# Altium project PX4FLOW2.0_X0.PrjPcb
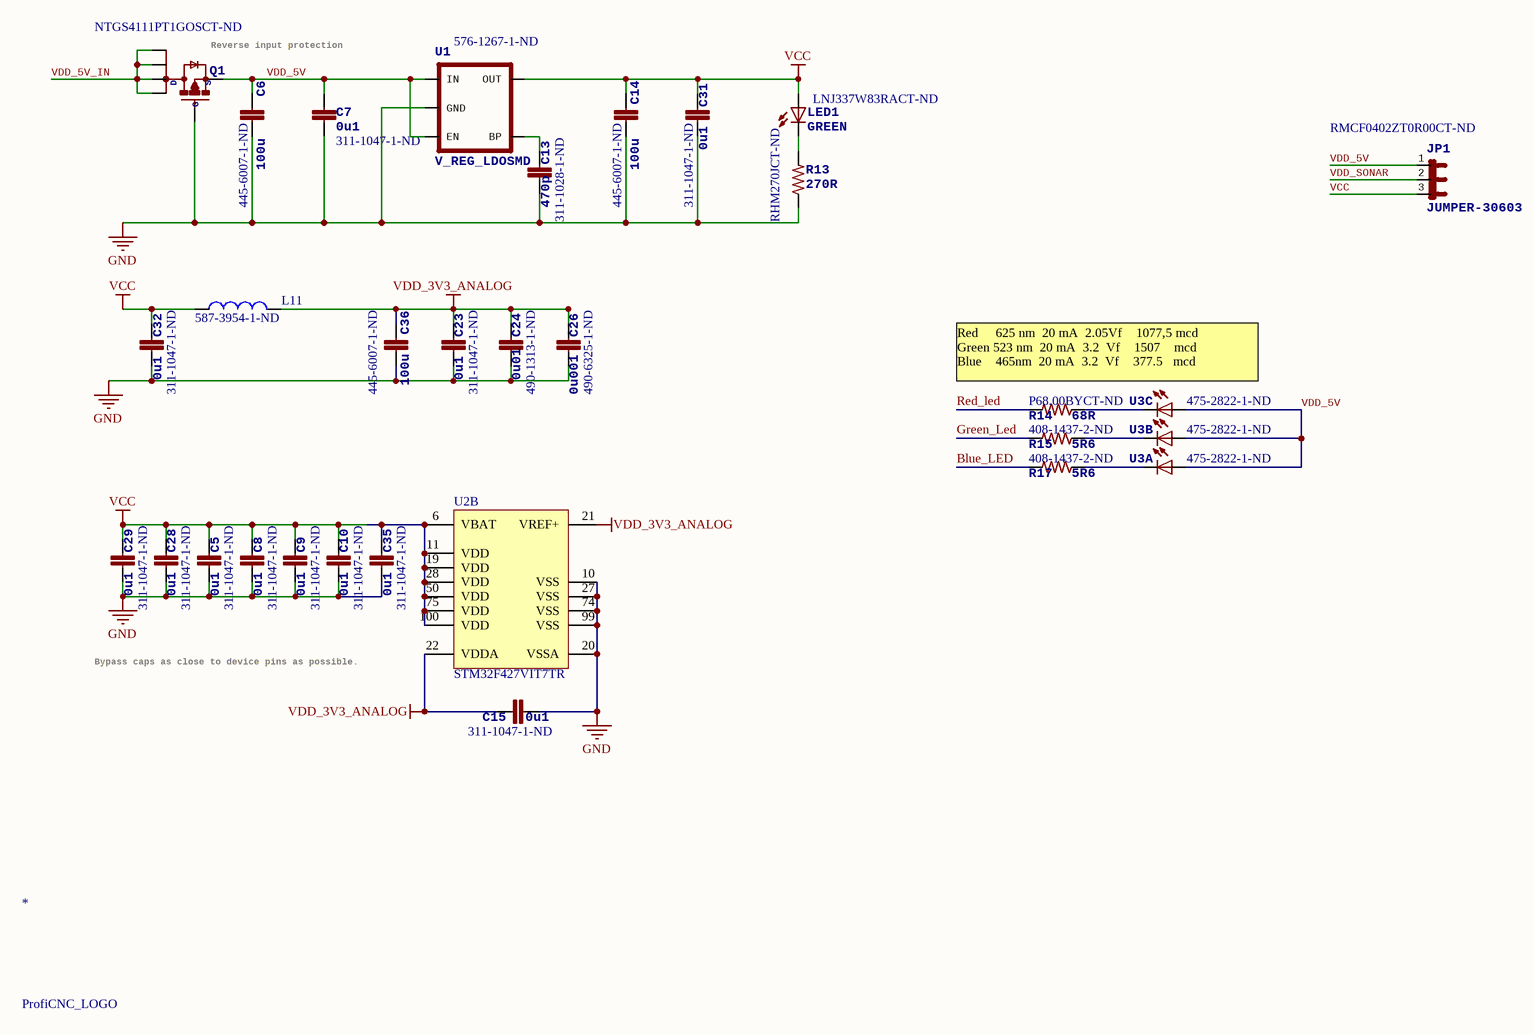
[diagram p0: PX4FLOW2.0_Power_X0.SchDoc]
5 sheets, 106 parts. Net scope: global (net labels, ports and power ports of the same name join across sheets).
Board file: PX4FLOW2.0_X0.PcbDoc
Sheets:
  PX4FLOW2.0_Power_X0.SchDoc
  PX4FLOW2.0_CPU_X0.SchDoc
  PX4FLOW2.0_Connectors_X0.SchDoc
  PX4FLOW2.0_CAM_X0.SchDoc
  PX4FLOW2.0_Sensors_CAN_X0.SchDoc

## Sheet PX4FLOW2.0_Power_X0.SchDoc
size A3; DrawnBy: Philip Rowse

### Parts
(Parts that share a designator on the sheet are numbered #1, #2 ... from top to bottom, then left to right.)
*#1  ProfiCNC_LOGO  [ProfiCNC_medium]  (no BOM)
C5  0u1  Supplier Part Number 1: 311-1047-1-ND  [0402-CAP]
C6  100u  Supplier Part Number 1: 445-6007-1-ND  [1206-CAP]
C7  0u1  Supplier Part Number 1: 311-1047-1-ND  [0402-CAP]
C8  0u1  Supplier Part Number 1: 311-1047-1-ND  [0402-CAP]
C9  0u1  Supplier Part Number 1: 311-1047-1-ND  [0402-CAP]
C10  0u1  Supplier Part Number 1: 311-1047-1-ND  [0402-CAP]
C13  470p  Supplier Part Number 1: 311-1028-1-ND  [0402-CAP]
C14  100u  Supplier Part Number 1: 445-6007-1-ND  [1206-CAP]
C15  0u1  Supplier Part Number 1: 311-1047-1-ND  [0402-CAP]
C23  0u1  Supplier Part Number 1: 311-1047-1-ND  [0402-CAP]
C24  0u01  Supplier Part Number 1: 490-1313-1-ND  [0402-CAP]
C26  0u001  Supplier Part Number 1: 490-6325-1-ND  [0402-CAP]
C28  0u1  Supplier Part Number 1: 311-1047-1-ND  [0402-CAP]
C29  0u1  Supplier Part Number 1: 311-1047-1-ND  [0402-CAP]
C31  0u1  Supplier Part Number 1: 311-1047-1-ND  [0402-CAP]
C32  0u1  Supplier Part Number 1: 311-1047-1-ND  [0402-CAP]
C35  0u1  Supplier Part Number 1: 311-1047-1-ND  [0402-CAP]
C36  100u  Supplier Part Number 1: 445-6007-1-ND  [1206-CAP]
JP1  JUMPER-30603  Supplier Part Number 1: RMCF0402ZT0R00CT-ND  [SJ_3_0603_PASTE1&2]
L11  Supplier Part Number 1: 587-3954-1-ND  [L0402]  (hidden comment: Inductor)
LED1  GREEN  Supplier Part Number 1: LNJ337W83RACT-ND  [LED-0603]
Q1  Supplier Part Number 1: NTGS4111PT1GOSCT-ND  [TSOP-6]  (hidden comment: NTGS4111P)
R13  270R  Supplier Part Number 1: RHM270JCT-ND  [R0402]
R14  68R  Supplier Part Number 1: P68.00BYCT-ND  [0603-RES]
R15  5R6  Supplier Part Number 1: 408-1437-2-ND  [0603-RES]
R17  5R6  Supplier Part Number 1: 408-1437-2-ND  [0603-RES]
U1  V_REG_LDOSMD  Supplier Part Number 1: 576-1267-1-ND  [SOT23-5]
U2  STM32F427VIT7TR  [STM-LQFP100_N]  (part B of 2)
U3  Supplier Part Number 1: 475-2822-1-ND  [6-PLCC]  (hidden comment: LRTB GFTG-T7AW-1+V7A7-29+R5T9-49-L)  (parts A,B,C of 3)

### Nets
GND: C5.2 C6.P$2 C7.1 C8.2 C9.2 C10.2 C13.2 C14.P$2 C15.2 C23.2 C24.2 C26.2 C28.2 C29.2 C31.2 C32.2 C35.2 C36.P$2 Q1.3(G) R13.1 U1.2(GND) U2.10(VSS) U2.20(VSSA) U2.27(VSS) U2.74(VSS) U2.99(VSS)
VCC: C5.1 C8.1 C9.1 C10.1 C14.P$1 C28.1 C29.1 C31.1 C32.1 C35.1 JP1.3 L11.1 LED1.A U1.5(OUT) U2.6(VBAT) U2.11(VDD) U2.19(VDD) U2.28(VDD) U2.50(VDD) U2.75(VDD) U2.100(VDD)
VDD_3V3_ANALOG: C15.1 C23.1 C24.1 C26.1 C36.P$1 L11.2 U2.21(VREF+) U2.22(VDDA)
Blue_LED: R17.2
Green_Led: R15.2
Red_led: R14.2
VDD_5V: C6.P$1 C7.2 JP1.1 Q1.4(S) U1.1(IN) U1.3(EN) U3.A1(A) U3.A2(A) U3.A3(A)
VDD_5V_IN: Q1.1(D) Q1.2(D1) Q1.5(D2) Q1.6(D3)
VDD_SONAR: JP1.2
NetC13_1: C13.1 U1.4(BP)
NetLED1_C: LED1.C R13.2
NetR14_1: R14.1 U3.C3(C)
NetR15_1: R15.1 U3.C2(C)
NetR17_1: R17.1 U3.C1(C)

### Notes on the sheet
- (near Q1) Reverse input protection
- Red     625 nm  20 mA  2.05Vf    1077,5 mcd
  Green 523 nm  20 mA  3.2  Vf    1507    mcd
  Blue    465nm  20 mA  3.2  Vf    377.5   mcd
- Bypass caps as close to device pins as possible.
- http://www.oshwa.org/
- http://creativecommons.org/licenses/by-sa/3.0/
- Title:
- Date:
- Time:
- Sheet:
- Approved:
- of:
- Drawn By:
- Checked By:
- ProfiCNC

### Library data of the parts
C5 C7-C10 C15 C23 C24 C26 C28 C29 C31 C32 = CAP0402-CAP: CapacitorStandard 0603 ceramic capacitor, and 0.1" leaded capacitor.; PARTNO: CC0402ZRY5V7BB104; Supplier 1: Digi-Key
C6 C14 C36 = CAP1206: CAP CER 100UF 10V 20% X5R 1206; PARTNO: C3216X5R1A107M160AC; 3DR_PARTNO: ECM0716; Supplier 1: Digi-Key; Value: 100U
C13 = CAP0402-CAP: CapacitorStandard 0603 ceramic capacitor, and 0.1" leaded capacitor.; PARTNO: CC0402KRX7R9BB471; Supplier 1: Digi-Key
C35 = CAP0402-CAP: 0402; PARTNO: CC0402ZRY5V7BB104; Supplier 1: Digi-Key
JP1 = JUMPER-30603: PARTNO: RMCF0402ZT0R00; Supplier 1: Digi-Key
L11 = Inductor: FERRITE BEAD 120 OHM 0402; Supplier 1: Digi-Key
LED1 = LED0603: Green LED; PARTNO: LNJ337W83RA; Supplier 1: Digi-Key
R13 = RESISTOR0402-RES: ResistorBasic schematic elements and footprints for 0603, 1206, and PTH 1/10th watt (small) resistors.; PARTNO: MCR01MZPJ271; Supplier 1: Digi-Key
R14 = RESISTOR0402-RES: RES SMD 68 OHM 1% 1/4W 0603; PARTNO: ERJ-PA3F68R0V; Supplier 1: Digi-Key
R15 R17 = RESISTOR0402-RES: RES SMD 5.6 OHM 1% 1/5W 0603; PARTNO: RL0816S-5R6-F; Supplier 1: Digi-Key
U1 = V_REG_LDOSMD: Voltage Regulator LDOStandard 150mA LDO voltage regulator in SOT-23 layout. Micrel part MIC5205. BP (by-pass) pin is used to lower output noise with 470pF cap.; PARTNO: MIC5207-3.3YM5; Supplier 1: Digi-Key
U2 = STM32F427VIT7TR: ARM Cortex-M4 32-bit MCU+FPU, 210 DMIPS, 2048 kB Flash, 256 kB Internal RAM, 82 I/Os, 100-pin LQFP, -40 to 105 degC, Tape and Reel; Manufacturer: STMicroelectronics; D/A Converter: 2x12-bit; FLASH Size (Prog) (kB): 2048; I/Os (High Current): 82; Internal RAM Size (kB): 256; Operating Frequency(F) (Processor speed) (MHz): 168; Supply Voltage(Vcc) max (V): 3.6; Supply Voltage(Vcc) min (V): 1.8; DatasheetVersion: Rev. 1; PackageVersion: Rev. 1, 06/2013; PackageReference: LQFP100; PackageDescription: 100-Pin Low Profile Quad Flat Package, 14 x 14 mm Body, 0.5 mm Pitch; Supplier 1: Newark; Supplier Part Number 1: 19X6230; Supplier 2: Mouser; Supplier Part Number 2: 511-STM32F427VIT7TR; Core: ARM Cortex-M4; Packing: Tape and Reel; Mounting Technology: Surface Mount; PartNumber: STM32F427VIT7TR; ComponentLink1Description: Manufacturer URL; ComponentLink1URL: http://www.st.com/web/en/home.html; ComponentLink2Description: Datasheet; ComponentLink2URL: http://www.st.com/st-web-ui/static/active/en/resource/technical/document/datasheet/DM00071990.pdf; ComponentLink3Description: Package Specification; ComponentLink3URL: http://www.st.com/st-web-ui/static/active/en/resource/technical/document/data_brief/DM00071938.pdf
U3 = RGB-LED6-PLCC: RGB LED with separate anode/cathode terminals; Supplier 1: Digi-Key
Q1 = NTGS4111P: PARTNO: NTGS4111P; D: D; S: S; G: G; Supplier 1: Digi-Key

## Sheet PX4FLOW2.0_CPU_X0.SchDoc
size A3; DrawnBy: Philip Rowse
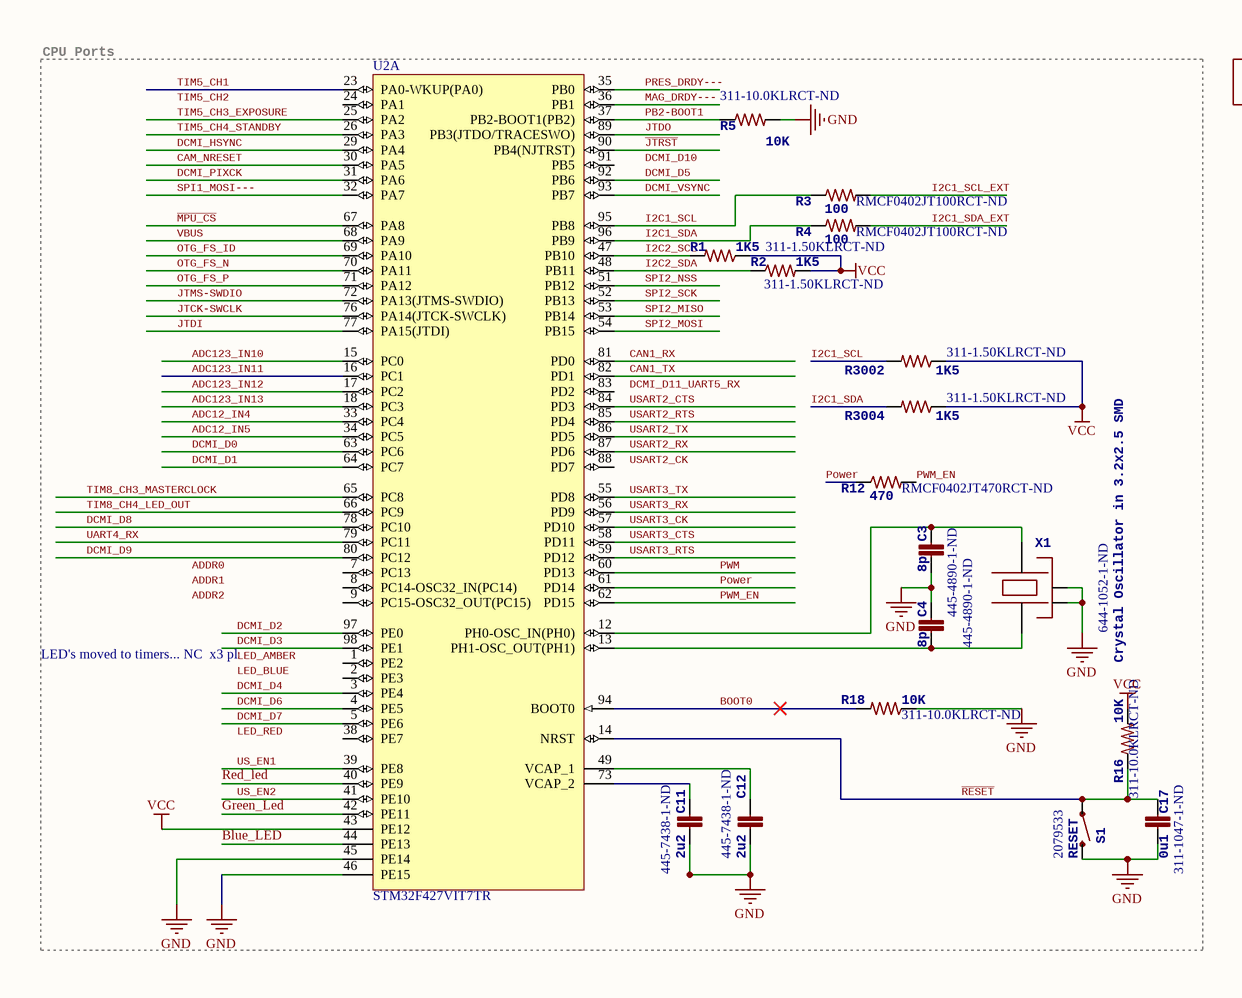
[diagram p1: PX4FLOW2.0_CPU_X0.SchDoc, left]
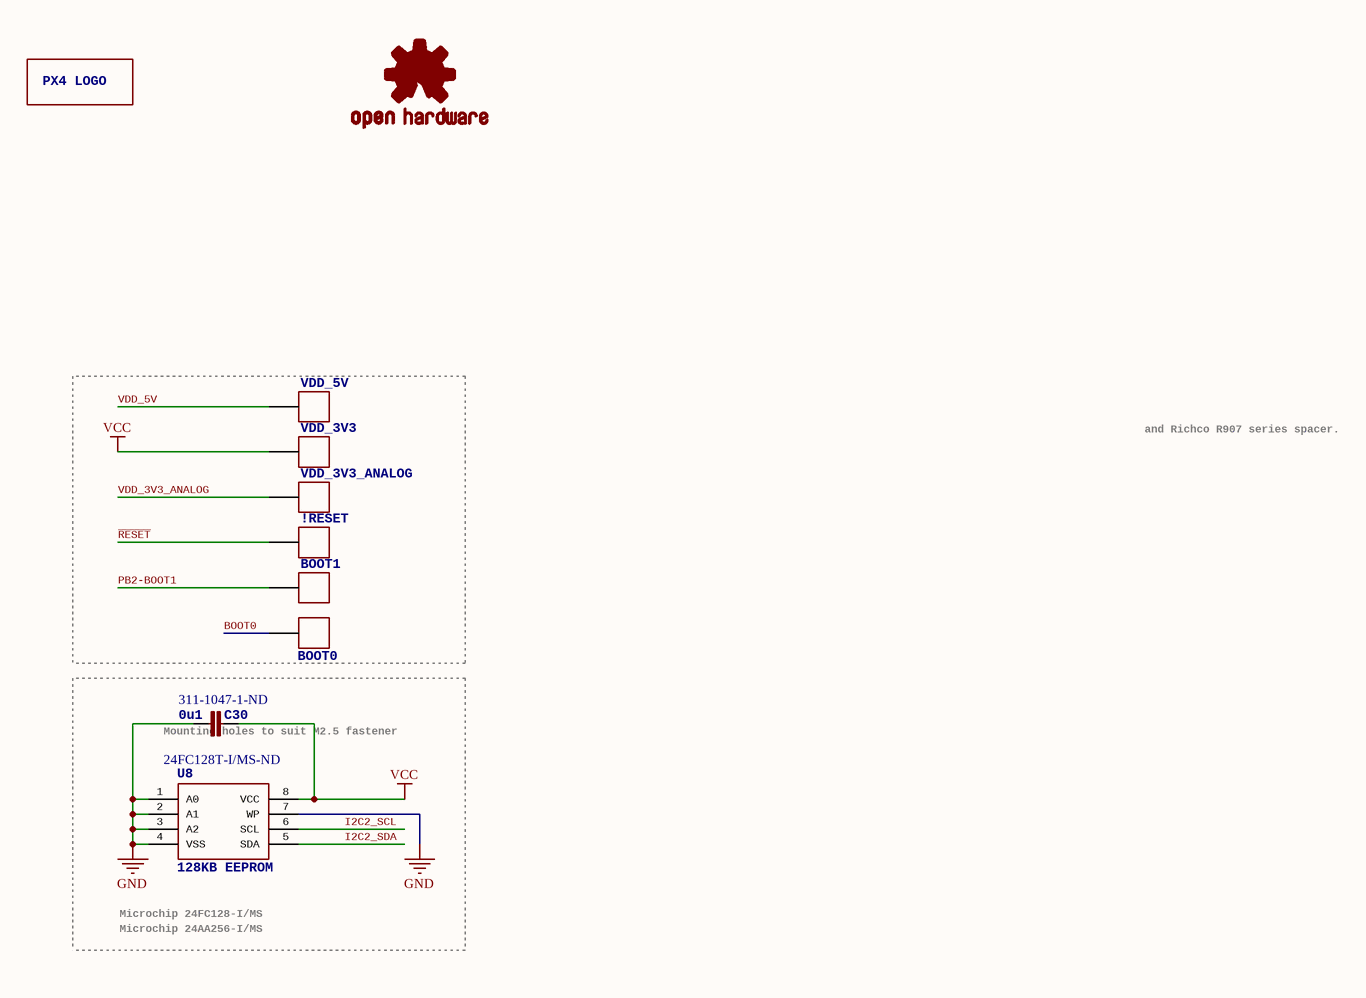
[diagram p2: PX4FLOW2.0_CPU_X0.SchDoc, right]

### Parts
!RESET  PAD.04  [PAD.04X.04]  (value not drawn)
BOOT0  PAD.05  [PAD.05X.05]  (value not drawn)
BOOT1  PAD.04  [PAD.04X.04]  (value not drawn)
C3  8p  Supplier Part Number 1: 445-4890-1-ND  [0402-CAP]
C4  8p  Supplier Part Number 1: 445-4890-1-ND  [0402-CAP]
C11  2u2  Supplier Part Number 1: 445-7438-1-ND  [0603-CAP]
C12  2u2  Supplier Part Number 1: 445-7438-1-ND  [0603-CAP]
C17  0u1  Supplier Part Number 1: 311-1047-1-ND  [0402-CAP]
C30  0u1  Supplier Part Number 1: 311-1047-1-ND  [0402-CAP]
R1  1K5  Supplier Part Number 1: 311-1.50KLRCT-ND  [R0402]
R2  1K5  Supplier Part Number 1: 311-1.50KLRCT-ND  [R0402]
R3  100  Supplier Part Number 1: RMCF0402JT100RCT-ND  [R0402]
R4  100  Supplier Part Number 1: RMCF0402JT100RCT-ND  [R0402]
R5  10K  Supplier Part Number 1: 311-10.0KLRCT-ND  [R0402]
R12  470  Supplier Part Number 1: RMCF0402JT470RCT-ND  [R0402]
R16  10K  Supplier Part Number 1: 311-10.0KLRCT-ND  [R0402]
R18  10K  Supplier Part Number 1: 311-10.0KLRCT-ND  [R0402]
R3002  1K5  Supplier Part Number 1: 311-1.50KLRCT-ND  [R0402]
R3004  1K5  Supplier Part Number 1: 311-1.50KLRCT-ND  [R0402]
S1  RESET  Supplier Part Number 1: 2079533  [EVQP7J01K]
U2  STM32F427VIT7TR  [STM-LQFP100_N]  (part A of 2)
U8  128KB EEPROM  Supplier Part Number 1: 24FC128T-I/MS-ND  [MSOP-8]
U$9  PX4LOGO: PX4 LOGO  [PX4-LOGO-20MM]  (hidden comment: PX4-LOGO-20MM)
U$10  OSHW-LOGOS  [OSHW-LOGO-S]  (value not drawn)
VDD_3V3  PAD.04  [PAD.04X.04]  (value not drawn)
VDD_3V3_ANALOG  PAD.04  [PAD.04X.04]  (value not drawn)
VDD_5V  PAD.04  [PAD.04X.04]  (value not drawn)
X1  Crystal Oscillator in 3.2x2.5 SMD  Supplier Part Number 1: 644-1052-1-ND  [OSCILLATOR-3.2X2.5]

### Nets
CAM_NRESET: U2.30(PA5)
GND: C3.P$2 C4.P$1 C11.P$2 C12.P$2 C17.1 C30.2 R5.2 R18.1 S1.B3 U2.45(PE14) U2.46(PE15) U8.1(A0) U8.2(A1) U8.3(A2) U8.4(VSS) U8.7(WP) X1.2(NC_2) X1.4(NC_4)
VCC: C30.1 R1.1 R2.2 R16.2 R3002.1 R3004.1 U2.43(PE12) U8.8(VCC) VDD_3V3.P$1
VDD_3V3_ANALOG: VDD_3V3_ANALOG.P$1
ADC12_IN4: U2.33(PC4)
ADC12_IN5: U2.34(PC5)
ADC123_IN10: U2.15(PC0)
ADC123_IN11: U2.16(PC1)
ADC123_IN12: U2.17(PC2)
ADC123_IN13: U2.18(PC3)
Blue_LED: U2.44(PE13)
BOOT0: BOOT0.P$1 R18.2 U2.94(BOOT0)
CAN1_RX: U2.81(PD0)
CAN1_TX: U2.82(PD1)
DCMI_D0: U2.63(PC6)
DCMI_D1: U2.64(PC7)
DCMI_D2: U2.97(PE0)
DCMI_D3: U2.98(PE1)
DCMI_D4: U2.3(PE4)
DCMI_D5: U2.92(PB6)
DCMI_D6: U2.4(PE5)
DCMI_D7: U2.5(PE6)
DCMI_D8: U2.78(PC10)
DCMI_D9: U2.80(PC12)
DCMI_HSYNC: U2.29(PA4)
DCMI_PIXCK: U2.31(PA6)
DCMI_VSYNC: U2.93(PB7)
Green_Led: U2.42(PE11)
I2C1_SCL: R3.1 R3002.2 U2.95(PB8)
I2C1_SCL_EXT: R3.2
I2C1_SDA: R4.1 R3004.2 U2.96(PB9)
I2C1_SDA_EXT: R4.2
I2C2_SCL: R1.2 U2.47(PB10) U8.6(SCL)
I2C2_SDA: R2.1 U2.48(PB11) U8.5(SDA)
~{JTRST}: U2.90(PB4(NJTRST))
JTCK-SWCLK: U2.76(PA14(JTCK-SWCLK))
JTDI: U2.77(PA15(JTDI))
JTDO: U2.89(PB3(JTDO/TRACESWO))
JTMS-SWDIO: U2.72(PA13(JTMS-SWDIO))
~{MPU_CS}: U2.67(PA8)
MAG_DRDY---: U2.36(PB1)
OTG_FS_ID: U2.69(PA10)
OTG_FS_N: U2.70(PA11)
OTG_FS_P: U2.71(PA12)
PB2-BOOT1: BOOT1.P$1 R5.1 U2.37(PB2-BOOT1(PB2))
Power: R12.1 U2.61(PD14)
PRES_DRDY---: U2.35(PB0)
PWM: U2.60(PD13)
PWM_EN: R12.2 U2.62(PD15)
~{RESET}: !RESET.P1 C17.2 R16.1 S1.A1 U2.14(NRST)
Red_led: U2.40(PE9)
SPI1_MOSI---: U2.32(PA7)
SPI2_MISO: U2.53(PB14)
SPI2_MOSI: U2.54(PB15)
SPI2_NSS: U2.51(PB12)
SPI2_SCK: U2.52(PB13)
TIM5_CH1: U2.23(PA0-WKUP(PA0))
TIM5_CH3_EXPOSURE: U2.25(PA2)
TIM5_CH4_STANDBY: U2.26(PA3)
TIM8_CH3_MASTERCLOCK: U2.65(PC8)
TIM8_CH4_LED_OUT: U2.66(PC9)
UART4_RX: U2.79(PC11)
US_EN1: U2.39(PE8)
US_EN2: U2.41(PE10)
USART2_CTS: U2.84(PD3)
USART2_RTS: U2.85(PD4)
USART2_RX: U2.87(PD6)
USART2_TX: U2.86(PD5)
USART3_CK: U2.57(PD10)
USART3_CTS: U2.58(PD11)
USART3_RTS: U2.59(PD12)
USART3_RX: U2.56(PD9)
USART3_TX: U2.55(PD8)
VBUS: U2.68(PA9)
VDD_5V: VDD_5V.P$1
NetC3_P$1: C3.P$1 U2.12(PH0-OSC_IN(PH0)) X1.3
NetC4_P$2: C4.P$2 U2.13(PH1-OSC_OUT(PH1)) X1.1
NetC11_P$1: C11.P$1 U2.73(VCAP_2)
NetC12_P$1: C12.P$1 U2.49(VCAP_1)

Not connected (* = marked no-connect by the designer): U2 1(PE2) 2(PE3) 7(PC13) 8(PC14-OSC32_IN(PC14)) 9(PC15-OSC32_OUT(PC15)) 24(PA1) 38(PE7) 83(PD2) 88(PD7) 91(PB5)

### Notes on the sheet
- CPU Ports
- and Richco R907 series spacer.
- LED's moved to timers... NC  x3 pl
- (near C30) Mounting holes to suit M2.5 fastener
- Microchip 24FC128-I/MS
- Microchip 24AA256-I/MS
- Labels drawn without touching a wire or pin: ADDR0, ADDR1, ADDR2, DCMI_D10, DCMI_D11_UART5_RX, LED_AMBER, LED_BLUE, LED_RED, TIM5_CH2, USART2_CK
- http://www.oshwa.org/
- http://creativecommons.org/licenses/by-sa/3.0/
- Title:
- Date:
- Time:
- Sheet:
- Approved:
- of:
- Drawn By:
- Checked By:
- ProfiCNC

### Library data of the parts
!RESET BOOT1 VDD_3V3 VDD_3V3_ANALOG VDD_5V = PAD.04: BOM: EXCLUDE; PARTNO: *
BOOT0 = PAD.05: Test pad This footprint includes three classes: The actual test pads, a pogo-pin footprint to mount the pogo-pin as through-hole part and a hole footprint which allows the head of the pogo-pin to pass through (do NOT use the hole to mount the pogo-pin). In a typical test setup, the stack would consist of three PCBs: The actual PCB under testing with a test pad on the bottom, then a second PCB with the hole for the pogo-pin head where the PCB under testing is pressed on and a third PCB at 30 mm / 1.2" distance with the pogo-pin footprints. The pogo-pins are soldered to the last PCB. To create the stack, copy the board under testing and exchange the footprints - this way the correct positioning is ensured.; BOM: EXCLUDE; PARTNO: *
C3 C4 = CAP0402: CAP CER 8PF 50V C0G 0402; PARTNO: C1005C0G1H080C; 3DR_PARTNO: ECM0710; Supplier 1: Digi-Key; Value: 8p
C11 C12 = CAP0603: Capacitor, 2.2uF, 16V, 10%, X6S, 0603, Ceramic; PARTNO: C1608X6S1C225K080AC; 3DR_PARTNO: ECM0619; Supplier 1: Digi-Key; Value: 2u2
C17 C30 = CAP0402-CAP: as C5 on sheet PX4FLOW2.0_Power_X0; Supplier 1: Digi-Key
R1 R2 R3002 R3004 = RESISTOR0402-RES: RES 1.5K OHM 1/16W 1% 0402 SMD; PARTNO: RC0402FR-071K5L; 3DR_PARTNO: ECM0803; Supplier 1: Digi-Key; Value: 1K5
R3 R4 R12 = RESISTOR0402-RES: ResistorBasic schematic elements and footprints for 0603, 1206, and PTH 1/10th watt (small) resistors.; PARTNO: RMCF0402JT100R; Supplier 1: Digi-Key
R5 R16 R18 = RESISTOR0402-RES: RES 10K OHM 1/16W 1% 0402 SMD; PARTNO: RC0402FR-0710KL; 3DR_PARTNO: ECM0800; Supplier 1: Digi-Key; Value: 10K
S1 = SWITCH-MOMENTARY-2: Switch; Supplier 1: Farnell
U2 = STM32F427VIT7TR: as U2 on sheet PX4FLOW2.0_Power_X0; DatasheetVersion: Rev. 1; PackageVersion: Rev. 1, 06/2013; PackageReference: LQFP100; PackageDescription: 100-Pin Low Profile Quad Flat Package, 14 x 14 mm Body, 0.5 mm Pitch; Supplier 1: Newark; Supplier Part Number 1: 19X6230; Supplier 2: Mouser; Supplier Part Number 2: 511-STM32F427VIT7TR; Core: ARM Cortex-M4; Packing: Tape and Reel; Mounting Technology: Surface Mount; PartNumber: STM32F427VIT7TR; ComponentLink1Description: Manufacturer URL; ComponentLink1URL: http://www.st.com/web/en/home.html; ComponentLink2Description: Datasheet; ComponentLink2URL: http://www.st.com/st-web-ui/static/active/en/resource/technical/document/datasheet/DM00071990.pdf; ComponentLink3Description: Package Specification; ComponentLink3URL: http://www.st.com/st-web-ui/static/active/en/resource/technical/document/data_brief/DM00071938.pdf
U8 = EEPROM-I2CMSOP: I2C EEPROM Generic footprint for I2C EEPROMS. Compatible types include:    Microchip 24FC128-I/MS    Microchip 24AA256-I/MS    ST Microelectronics M24128-BWDW6TP; PARTNO: 24FC128-I/MS; Supplier 1: Digi-Key
U$9 = PX4-LOGO-20MM: BOM: EXCLUDE; PARTNO: *
U$10 = OSHW-LOGOS: Open Source Hardware Logo This logo indicates the piece of hardware it is found on incorporates a OSHW license and/or adheres to the definition of open source hardware found here: http://freedomdefined.org/OSHW; BOM: EXCLUDE; PARTNO: *
X1 = OSCILLATOR-3.2X2.5: CRYSTAL 24MHZ 8PF SMD; 3DR_PARTNO: ECM0708; PARTNO: NX3225SA-24.000MHZ-STD-CSR-1; Supplier 1: Digi-Key; Value: 24MHz

## Sheet PX4FLOW2.0_Connectors_X0.SchDoc
size A3; DrawnBy: Philip Rowse
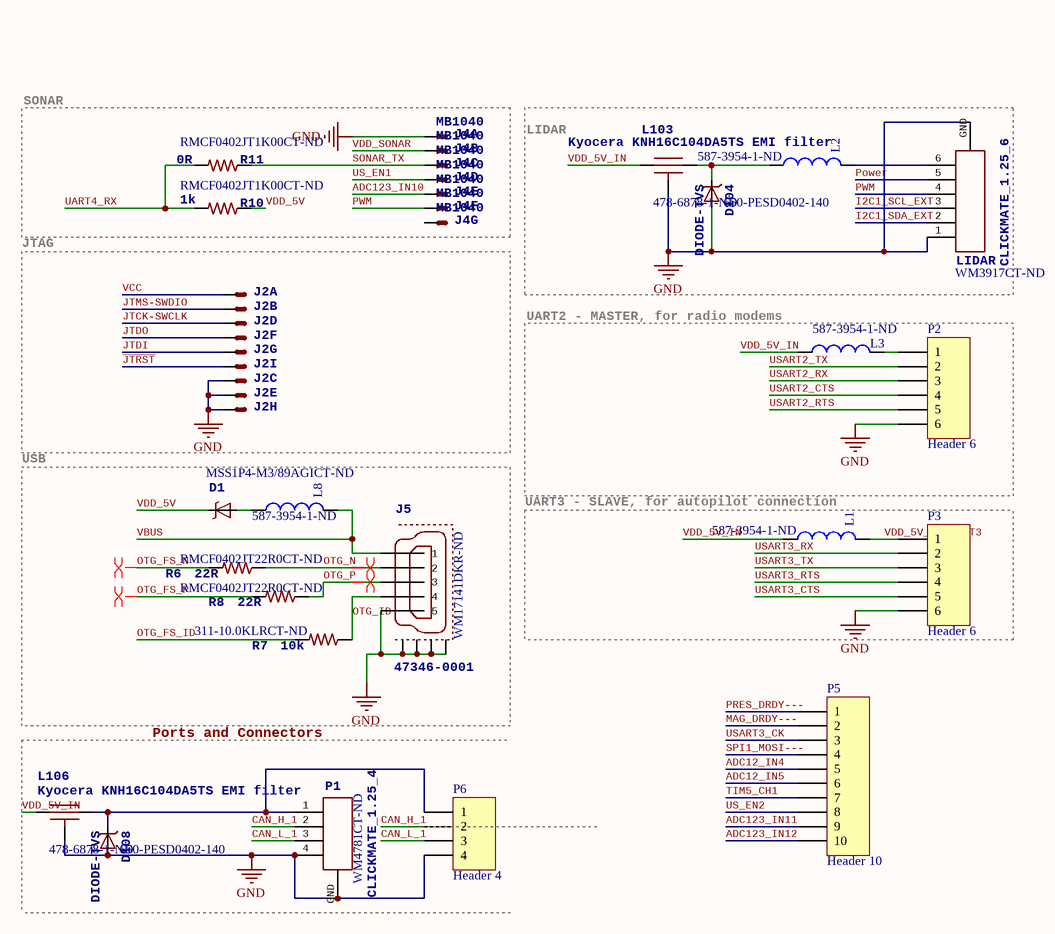
[diagram p3: PX4FLOW2.0_Connectors_X0.SchDoc]

### Parts
D1  Supplier Part Number 1: MSS1P4-M3/89AGICT-ND  [MICROSMP]  (hidden comment: MSS1P4-M3)
D104  DIODE-TVS  Supplier Part Number 1: 650-PESD0402-140  [0402-TVS]
D108  DIODE-TVS  Supplier Part Number 1: 650-PESD0402-140  [0402-TVS]
J2  (no value)  [FTSH-105-01-XXX-DV-K]  (parts A,B,C,D,E,F,G,H,I of 9)
J4  MB1040  [MAXSONAR]  (parts A,B,C,D,E,F,G of 7)
J5  47346-0001  Supplier Part Number 1: WM17141DKR-ND  [MOLEX-47346-0001]
L1  Supplier Part Number 1: 587-3954-1-ND  [L0402]  (hidden comment: Inductor)
L2  Supplier Part Number 1: 587-3954-1-ND  [L0402]  (hidden comment: Inductor)
L3  Supplier Part Number 1: 587-3954-1-ND  [L0402]  (hidden comment: Inductor)
L8  Supplier Part Number 1: 587-3954-1-ND  [L0402]  (hidden comment: FERRITE BEAD 120 OHM 0402)
L103  Kyocera KNH16C104DA5TS EMI filter  Supplier Part Number 1: 478-6878-1-ND  [KYOCERA-KNH16-DA]
L106  Kyocera KNH16C104DA5TS EMI filter  Supplier Part Number 1: 478-6878-1-ND  [KYOCERA-KNH16-DA]
LIDAR  CLICKMATE_1.25_6  Supplier Part Number 1: WM3917CT-ND  [CLICKMATE_H6]
P1  CLICKMATE_1.25_4  Supplier Part Number 1: WM4781CT-ND  [CLICKMATE_V4]
P2  Header 6  [HDR1X6]
P3  Header 6  [HDR1X6]
P5  Header 10  [HDR1X10]
P6  Header 4  [HDR1X4]
R6  22R  Supplier Part Number 1: RMCF0402JT22R0CT-ND  [R0402]
R7  10k  Supplier Part Number 1: 311-10.0KLRCT-ND  [R0402]
R8  22R  Supplier Part Number 1: RMCF0402JT22R0CT-ND  [R0402]
R10  1k  Supplier Part Number 1: RMCF0402JT1K00CT-ND  [R0402]
R11  0R  Supplier Part Number 1: RMCF0402JT1K00CT-ND  [R0402]

### Blocks framed on the sheet
SONAR: J4 R10 R11
LIDAR: D104 L2 L103 LIDAR
JTAG: J2
UART2 - MASTER, for radio modems: L3 P2
USB: D1 J5 L8 R6-R8
UART3 - SLAVE, for autopilot connection: L1 P3

### Nets
GND: D104.A D108.A J2.3(S) J2.5(S) J2.9(S) J4.GND(S) J5.GND(5) J5.GND1 J5.GND2 J5.GND3 J5.GND4 L103.GND L106.GND LIDAR.1 LIDAR.GND P1.4 P1.GND P2.6 P3.6 P6.4
VCC: J2.1(S)
ADC12_IN4: P5.5
ADC12_IN5: P5.6
ADC123_IN10: J4.AN(S)
ADC123_IN11: P5.9
ADC123_IN12: P5.10
CAN_H_1: P1.2 P6.2
CAN_L_1: P1.3 P6.3
I2C1_SCL_EXT: LIDAR.3
I2C1_SDA_EXT: LIDAR.2
~{JTRST}: J2.10(S)
JTCK-SWCLK: J2.4(S)
JTDI: J2.8(S)
JTDO: J2.6(S)
JTMS-SWDIO: J2.2(S)
MAG_DRDY---: P5.2
OTG_FS_ID: R7.2
OTG_FS_N: R6.2
OTG_FS_P: R8.2
OTG_ID: J5.ID(4) R7.1
OTG_N: J5.D-(2) R6.1
OTG_P: J5.D+(3) R8.1
Power: LIDAR.5
PRES_DRDY---: P5.1
PWM: J4.PW(S) LIDAR.4
SONAR_TX: J4.TX(S) R11.1
SPI1_MOSI---: P5.4
TIM5_CH1: P5.7
UART4_RX: R10.2 R11.2
US_EN1: J4.RX(S)
US_EN2: P5.8
USART2_CTS: P2.4
USART2_RTS: P2.5
USART2_RX: P2.3
USART2_TX: P2.2
USART3_CK: P5.3
USART3_CTS: P3.5
USART3_RTS: P3.4
USART3_RX: P3.2
USART3_TX: P3.3
VBUS: J5.VBUS(1) L8.2
VDD_5V: D1.CATHODE(C) R10.1
VDD_5V_IN: L1.1 L3.1 L103.P$1 L106.P$1
VDD_5V_IN_UART3: L1.2 P3.1
VDD_SONAR: J4.VDD(S)
NetD1_ANODE: D1.ANODE(A) L8.1
NetD104_C: D104.C L2.1 L103.P$2
NetD108_C: D108.C L106.P$2 P1.1 P6.1
NetL2_2: L2.2 LIDAR.6
NetL3_2: L3.2 P2.1

Not connected (* = marked no-connect by the designer): J4 BW(S)

### Layout directives
differential pair: OTG_FS_N, OTG_FS_P, OTG_N, OTG_P

### Notes on the sheet
- Ports and Connectors
- http://www.oshwa.org/
- http://creativecommons.org/licenses/by-sa/3.0/
- Title:
- Date:
- Time:
- Sheet:
- Approved:
- of:
- Drawn By:
- Checked By:
- ProfiCNC

### Library data of the parts
D1 = DIODE-SCHOTTKY_MSMP: Schottky barrier diode in DO214AC, e.g. Fairchild SS14.; Supplier 1: Digi-Key
D104 D108 = DIODE-TVS: Diode, TVS, 14VWM, 40VC, 0402, SMD; 3DR_PARTNO: ECM0837; Supplier 1: Mouser
J2 = ARM_MINI_JTAG-SMT
J4 = MAXSONAR: BOM: EXCLUDE; PARTNO: *
J5 = MOLEX-47346-0001: MICRO USB B, BOTTOM MOUNT; 3DR_PARTNO: ECM0486; PARTNO: 0473460001; Supplier 1: Digi-Key
L1-L3 = Inductor: FERRITE BEAD 120 OHM 0402; Supplier 1: Digi-Key
L8 = Inductor: Supplier 1: Digi-Key
L103 L106 = KNH16C104DA5TS: Capacitor, Filter, 0.1uF, 25V, 2A, 0603, SMD; 3DR_PARTNO: ECM0719; Supplier 1: Digi-Key
LIDAR = CLICKMATE_1.25_6: 1.25 W/B SGL R/A REC ASSY 6CKT; 3DR_PARTNO: ECM0532; Supplier 1: Digi-Key
P1 = CLICKMATE_1.25_4: Connector, Rcpt, 4Pos, 1.25MM, W/B, VERT, SMD, Tin; 3DR_PARTNO: PRT0441; Supplier 1: Digi-Key
P2 P3 = Header 6: Header, 6-Pin; LatestRevisionDate: 17-Jul-2002; LatestRevisionNote: Re-released for DXP Platform.; Publisher: Altium Limited
P5 = Header 10: Header, 10-Pin; LatestRevisionDate: 17-Jul-2002; LatestRevisionNote: Re-released for DXP Platform.; Publisher: Altium Limited
P6 = Header 4: Header, 4-Pin; LatestRevisionDate: 17-Jul-2002; LatestRevisionNote: Re-released for DXP Platform.; Publisher: Altium Limited
R6 R8 = RESISTOR0402-RES: ResistorBasic schematic elements and footprints for 0603, 1206, and PTH 1/10th watt (small) resistors.; PARTNO: RMCF0402JT22R0; Supplier 1: Digi-Key
R7 = RESISTOR0402-RES: RES 10K OHM 1/16W 1% 0402 SMD; PARTNO: MFR-25FBF-10K0; Supplier 1: Digi-Key
R10 R11 = RESISTOR0402-RES: ResistorBasic schematic elements and footprints for 0603, 1206, and PTH 1/10th watt (small) resistors.; PARTNO: RMCF0402JT1K00; Supplier 1: Digi-Key

## Sheet PX4FLOW2.0_CAM_X0.SchDoc
size A3; DrawnBy: Philip Rowse
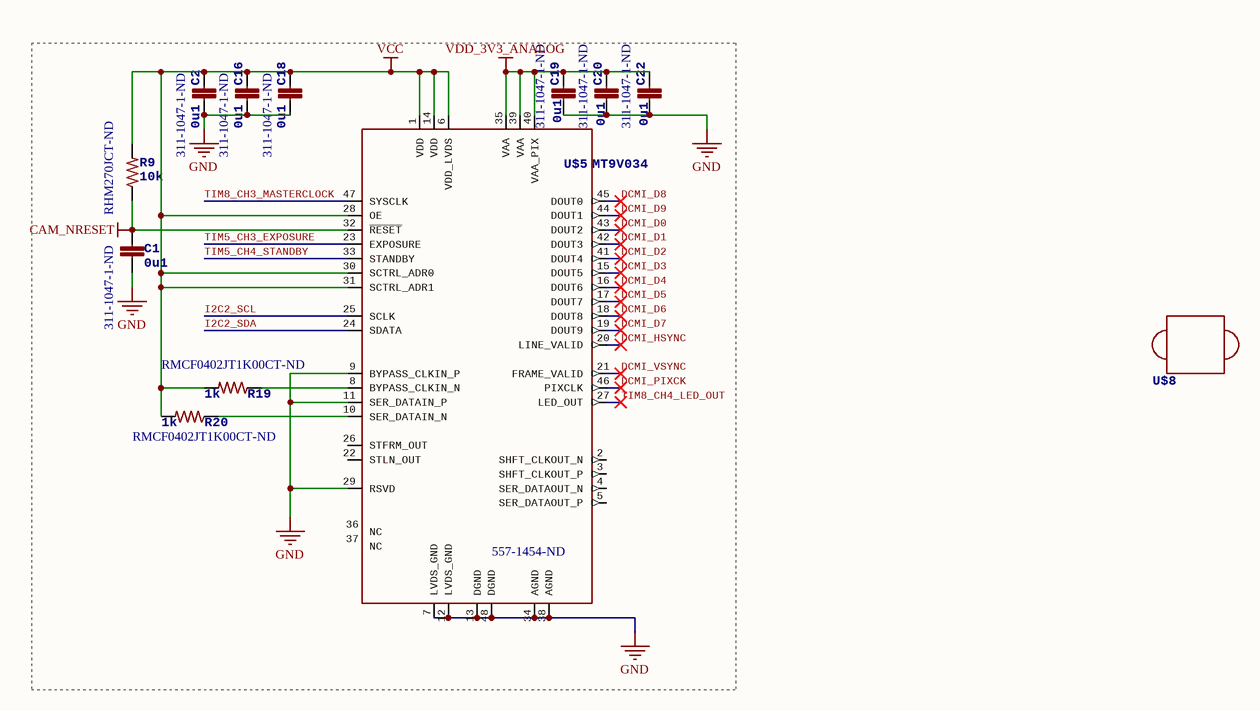
[diagram p4: PX4FLOW2.0_CAM_X0.SchDoc]

### Parts
C1  0u1  Supplier Part Number 1: 311-1047-1-ND  [0402-CAP]
C2  0u1  Supplier Part Number 1: 311-1047-1-ND  [0402-CAP]
C16  0u1  Supplier Part Number 1: 311-1047-1-ND  [0402-CAP]
C18  0u1  Supplier Part Number 1: 311-1047-1-ND  [0402-CAP]
C19  0u1  Supplier Part Number 1: 311-1047-1-ND  [0402-CAP]
C20  0u1  Supplier Part Number 1: 311-1047-1-ND  [0402-CAP]
C22  0u1  Supplier Part Number 1: 311-1047-1-ND  [0402-CAP]
R9  10k  Supplier Part Number 1: RHM270JCT-ND  [R0402]
R19  1k  Supplier Part Number 1: RMCF0402JT1K00CT-ND  [R0402]
R20  1k  Supplier Part Number 1: RMCF0402JT1K00CT-ND  [R0402]
U$5  MT9V034  Supplier Part Number 1: 557-1454-ND  [CLCC-48]
U$8  LENSMOUNT_M12  [LENSMOUNT_LARGE_M12]  (value not drawn)

### Nets
CAM_NRESET: C1.1 R9.1 U$5.32(~{RESET})
GND: C1.2 C2.2 C16.2 C18.2 C19.2 C20.2 C22.2 U$5.7(LVDS_GND) U$5.9(BYPASS_CLKIN_P) U$5.11(SER_DATAIN_P) U$5.12(LVDS_GND) U$5.13(DGND) U$5.29(RSVD) U$5.34(AGND) U$5.38(AGND) U$5.48(DGND)
VCC: C2.1 C16.1 C18.1 R9.2 R19.2 R20.2 U$5.1(VDD) U$5.6(VDD_LVDS) U$5.14(VDD) U$5.28(OE) U$5.30(SCTRL_ADR0) U$5.31(SCTRL_ADR1)
VDD_3V3_ANALOG: C19.1 C20.1 C22.1 U$5.35(VAA) U$5.39(VAA) U$5.40(VAA_PIX)
DCMI_D0: U$5.43(DOUT2)
DCMI_D1: U$5.42(DOUT3)
DCMI_D2: U$5.41(DOUT4)
DCMI_D3: U$5.15(DOUT5)
DCMI_D4: U$5.16(DOUT6)
DCMI_D5: U$5.17(DOUT7)
DCMI_D6: U$5.18(DOUT8)
DCMI_D7: U$5.19(DOUT9)
DCMI_D8: U$5.45(DOUT0)
DCMI_D9: U$5.44(DOUT1)
DCMI_HSYNC: U$5.20(LINE_VALID)
DCMI_PIXCK: U$5.46(PIXCLK)
DCMI_VSYNC: U$5.21(FRAME_VALID)
I2C2_SCL: U$5.25(SCLK)
I2C2_SDA: U$5.24(SDATA)
TIM5_CH3_EXPOSURE: U$5.23(EXPOSURE)
TIM5_CH4_STANDBY: U$5.33(STANDBY)
TIM8_CH3_MASTERCLOCK: U$5.47(SYSCLK)
TIM8_CH4_LED_OUT: U$5.27(LED_OUT)
NetR19_1: R19.1 U$5.8(BYPASS_CLKIN_N)
NetR20_1: R20.1 U$5.10(SER_DATAIN_N)

Not connected (* = marked no-connect by the designer): U$5 2(SHFT_CLKOUT_N) 3(SHFT_CLKOUT_P) 4(SER_DATAOUT_N) 5(SER_DATAOUT_P) 22(STLN_OUT) 26(STFRM_OUT) 36(NC) 37(NC)

### Notes on the sheet
- http://www.oshwa.org/
- http://creativecommons.org/licenses/by-sa/3.0/
- Title:
- Date:
- Time:
- Sheet:
- Approved:
- of:
- Drawn By:
- Checked By:
- ProfiCNC

### Library data of the parts
C1 C2 C16 C18-C20 C22 = CAP0402-CAP: as C5 on sheet PX4FLOW2.0_Power_X0; Supplier 1: Digi-Key
R9 = RESISTOR0402-RES: as R13 on sheet PX4FLOW2.0_Power_X0; Supplier 1: Digi-Key
R19 R20 = RESISTOR0402-RES: as R10 on sheet PX4FLOW2.0_Connectors_X0; Supplier 1: Digi-Key
U$5 = MT9V034: PARTNO: MT9V034C12STM; Supplier 1: Digi-Key
U$8 = LENSMOUNT_M12: Point Grey compatible M12 lens mount; BOM: EXCLUDE; PARTNO: *

## Sheet PX4FLOW2.0_Sensors_CAN_X0.SchDoc
size A3; DrawnBy: Philip Rowse
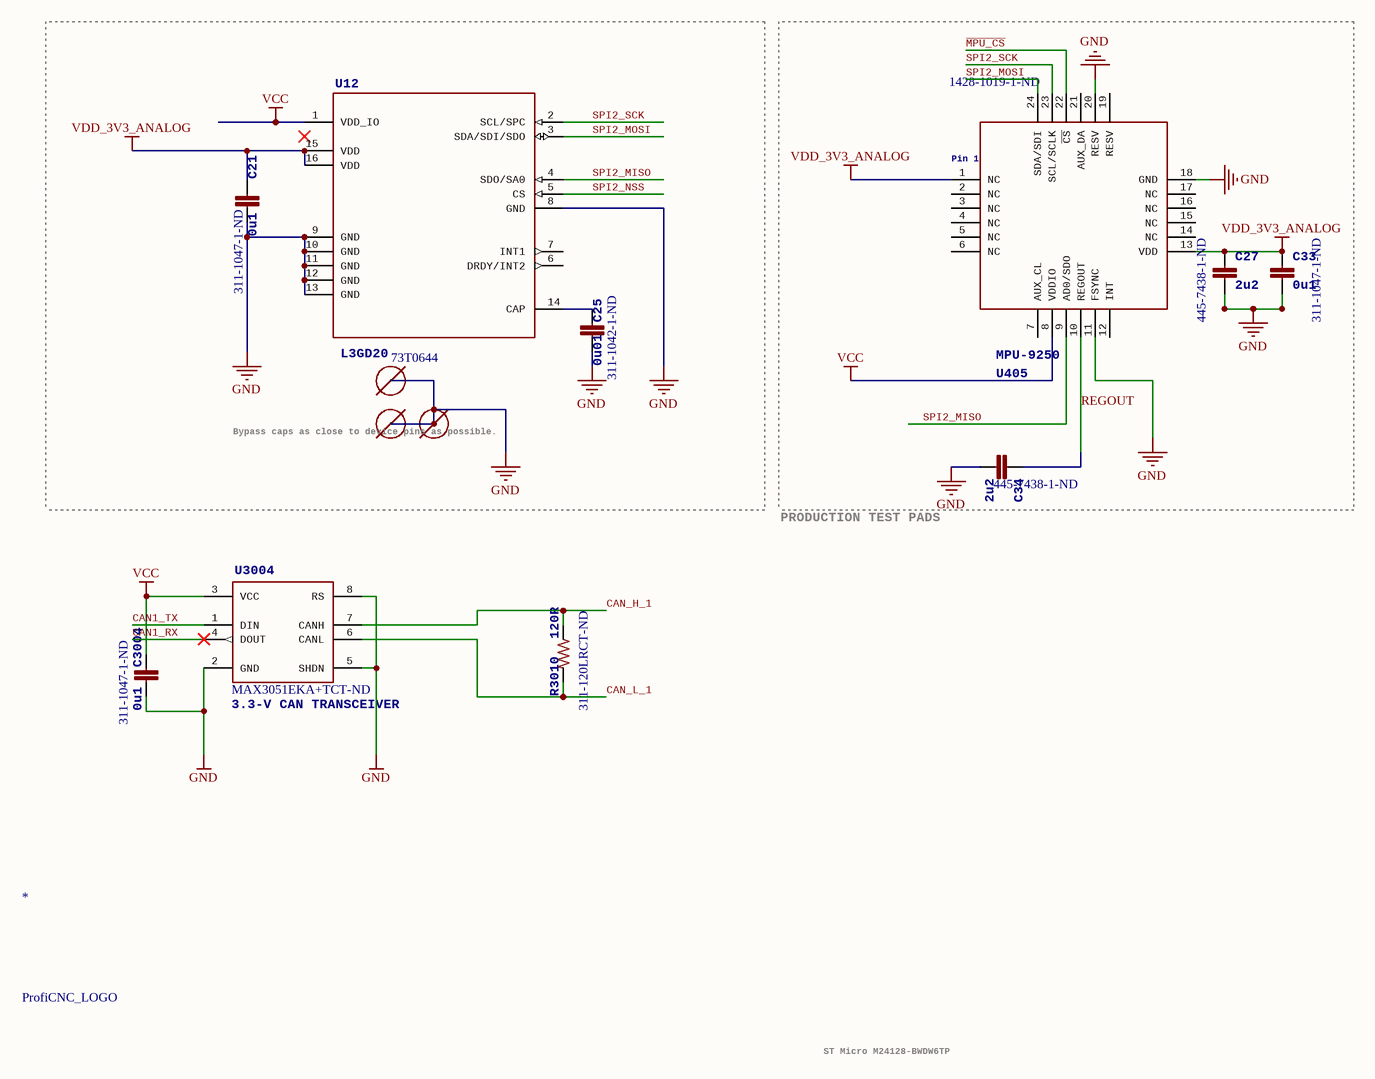
[diagram p5: PX4FLOW2.0_Sensors_CAN_X0.SchDoc]

### Parts
(Parts that share a designator on the sheet are numbered #1, #2 ... from top to bottom, then left to right.)
*#2  ProfiCNC_LOGO  [ProfiCNC_medium]  (no BOM)
C21  0u1  Supplier Part Number 1: 311-1047-1-ND  [0402-CAP]
C25  0u01  Supplier Part Number 1: 311-1042-1-ND  [0402-CAP]
C27  2u2  Supplier Part Number 1: 445-7438-1-ND  [0603-CAP]
C33  0u1  Supplier Part Number 1: 311-1047-1-ND  [0402-CAP]
C34  2u2  Supplier Part Number 1: 445-7438-1-ND  [0603-CAP]
C3004  0u1  Supplier Part Number 1: 311-1047-1-ND  [0402-CAP]
R3010  120R  Supplier Part Number 1: 311-120LRCT-ND  [R0402]
U12  L3GD20  Supplier Part Number 1: 73T0644  [L3GD20]
U405  MPU-9250  Supplier Part Number 1: 1428-1019-1-ND  [MPU-6500]
U3004  3.3-V CAN TRANSCEIVER  Supplier Part Number 1: MAX3051EKA+TCT-ND  [SOT23-8]
U$1  MOUNT-HOLE3.1MM  [MOUNT-HOLE3.1]  (value not drawn)
U$3  MOUNT-HOLE3.1MM  [MOUNT-HOLE3.1]  (value not drawn)
U$4  MOUNT-HOLE3.1MM  [MOUNT-HOLE3.1]  (value not drawn)

### Blocks framed on the sheet
Bypass caps as close to device pins as possible.: C21 C25 U12 U$1 U$3 U$4

### Nets
GND: C21.2 C25.2 C27.P$2 C33.P$2 C34.P$2 C3004.P$2 U12.8(GND) U12.9(GND) U12.10(GND) U12.11(GND) U12.12(GND) U12.13(GND) U405.11(FSYNC) U405.18(GND) U405.20(RESV) U3004.2(GND) U3004.5(SHDN) U3004.8(RS) U$1.1 U$3.1 U$4.1
VCC: C3004.P$1 U12.1(VDD_IO) U405.8(VDDIO) U3004.3(VCC)
VDD_3V3_ANALOG: C21.1 C27.P$1 C33.P$1 U12.15(VDD) U12.16(VDD) U405.1(NC) U405.13(VDD)
CAN1_RX: U3004.4(DOUT)
CAN1_TX: U3004.1(DIN)
CAN_H_1: R3010.1 U3004.7(CANH)
CAN_L_1: R3010.2 U3004.6(CANL)
~{MPU_CS}: U405.22(~{CS})
REGOUT: C34.P$1 U405.10(REGOUT)
SPI2_MISO: U12.4(SDO/SA0) U405.9(AD0/SDO)
SPI2_MOSI: U12.3(SDA/SDI/SDO) U405.24(SDA/SDI)
SPI2_NSS: U12.5(CS)
SPI2_SCK: U12.2(SCL/SPC) U405.23(SCL/SCLK)
NetC25_1: C25.1 U12.14(CAP)

Not connected (* = marked no-connect by the designer): U12 6(DRDY/INT2) 7(INT1); U405 2(NC) 3(NC) 4(NC) 5(NC) 6(NC) 7(AUX_CL) 12(INT) 14(NC) 15(NC) 16(NC) 17(NC) 19(RESV) 21(AUX_DA)

### Notes on the sheet
- PRODUCTION TEST PADS
- ST Micro M24128-BWDW6TP
- http://www.oshwa.org/
- http://creativecommons.org/licenses/by-sa/3.0/
- Title:
- Date:
- Time:
- Sheet:
- Approved:
- of:
- Drawn By:
- Checked By:
- ProfiCNC

### Library data of the parts
C21 = CAP0402-CAP: as C5 on sheet PX4FLOW2.0_Power_X0; Supplier 1: Digi-Key
C25 = CAP0402-CAP: CapacitorStandard 0603 ceramic capacitor, and 0.1" leaded capacitor.; PARTNO: CC0402KRX7R7BB103; Supplier 1: Digi-Key
C27 C34 = CAPACITOR-0603: Capacitor, 2.2uF, 16V, 10%, X6S, 0603, Ceramic; PARTNO: C1608X6S1C225K080AC; 3DR_PARTNO: ECM0619; Supplier 1: Digi-Key; Value: 2u2
C33 = CAPACITOR-0402: Capacitor, 0.1uF, 16V, Y5V, 0402, Ceramic; PARTNO: CC0402ZRY5V7BB104; 3DR_PARTNO: ECM0700; Supplier 1: Digi-Key; Value: 0u1
C3004 = CAP0402: CAP CER 0.1UF 16V Y5V 0402; PARTNO: CC0402ZRY5V7BB104; 3DR_PARTNO: ECM0700; Supplier 1: Digi-Key; Value: 0u1
R3010 = RESISTOR0402-RES: RES 120 OHM 1/16W 1% 0402 SMD; PARTNO: RC0402FR-07120RL; 3DR_PARTNO: ECM0820; Supplier 1: Digi-Key; Value: 120R
U12 = L3GD20: Sensor, Low-power, Three-axis, Angular rate; 3DR_PARTNO: ECM0827; MFGPN: L3GD20; Supplier 1: Newark
U405 = MPU-6500: PARTNO: MPU-9250; Pin 1: Pin 1; Supplier 1: Digi-Key
U3004 = MAX3051MAX3051EKA: IC TXRX CAN 1MBPS SOT23-8; 3DR_PARTNO: ECM0831; PARTNO: MAX3051EKA+T; Supplier 1: Digi-Key; Value: CAN

## Nets that join several sheets
CAM_NRESET: PX4FLOW2.0_CPU_X0 (U2.30), PX4FLOW2.0_CAM_X0 (C1.1 R9.1 U$5.32)
GND: PX4FLOW2.0_Power_X0 (26 pins), PX4FLOW2.0_CPU_X0 (18 pins), PX4FLOW2.0_Connectors_X0 (20 pins), PX4FLOW2.0_CAM_X0 (16 pins), PX4FLOW2.0_Sensors_CAN_X0 (21 pins)
VCC: PX4FLOW2.0_Power_X0 (21 pins), PX4FLOW2.0_CPU_X0 (9 pins), PX4FLOW2.0_Connectors_X0 (J2.1), PX4FLOW2.0_CAM_X0 (12 pins), PX4FLOW2.0_Sensors_CAN_X0 (C3004.P$1 U12.1 U405.8 U3004.3)
VDD_3V3_ANALOG: PX4FLOW2.0_Power_X0 (8 pins), PX4FLOW2.0_CPU_X0 (VDD_3V3_ANALOG.P$1), PX4FLOW2.0_CAM_X0 (6 pins), PX4FLOW2.0_Sensors_CAN_X0 (7 pins)
ADC12_IN4: PX4FLOW2.0_CPU_X0 (U2.33), PX4FLOW2.0_Connectors_X0 (P5.5)
ADC12_IN5: PX4FLOW2.0_CPU_X0 (U2.34), PX4FLOW2.0_Connectors_X0 (P5.6)
ADC123_IN10: PX4FLOW2.0_CPU_X0 (U2.15), PX4FLOW2.0_Connectors_X0 (J4.AN)
ADC123_IN11: PX4FLOW2.0_CPU_X0 (U2.16), PX4FLOW2.0_Connectors_X0 (P5.9)
ADC123_IN12: PX4FLOW2.0_CPU_X0 (U2.17), PX4FLOW2.0_Connectors_X0 (P5.10)
Blue_LED: PX4FLOW2.0_Power_X0 (R17.2), PX4FLOW2.0_CPU_X0 (U2.44)
CAN1_RX: PX4FLOW2.0_CPU_X0 (U2.81), PX4FLOW2.0_Sensors_CAN_X0 (U3004.4)
CAN1_TX: PX4FLOW2.0_CPU_X0 (U2.82), PX4FLOW2.0_Sensors_CAN_X0 (U3004.1)
CAN_H_1: PX4FLOW2.0_Connectors_X0 (P1.2 P6.2), PX4FLOW2.0_Sensors_CAN_X0 (R3010.1 U3004.7)
CAN_L_1: PX4FLOW2.0_Connectors_X0 (P1.3 P6.3), PX4FLOW2.0_Sensors_CAN_X0 (R3010.2 U3004.6)
DCMI_D0: PX4FLOW2.0_CPU_X0 (U2.63), PX4FLOW2.0_CAM_X0 (U$5.43)
DCMI_D1: PX4FLOW2.0_CPU_X0 (U2.64), PX4FLOW2.0_CAM_X0 (U$5.42)
DCMI_D2: PX4FLOW2.0_CPU_X0 (U2.97), PX4FLOW2.0_CAM_X0 (U$5.41)
DCMI_D3: PX4FLOW2.0_CPU_X0 (U2.98), PX4FLOW2.0_CAM_X0 (U$5.15)
DCMI_D4: PX4FLOW2.0_CPU_X0 (U2.3), PX4FLOW2.0_CAM_X0 (U$5.16)
DCMI_D5: PX4FLOW2.0_CPU_X0 (U2.92), PX4FLOW2.0_CAM_X0 (U$5.17)
DCMI_D6: PX4FLOW2.0_CPU_X0 (U2.4), PX4FLOW2.0_CAM_X0 (U$5.18)
DCMI_D7: PX4FLOW2.0_CPU_X0 (U2.5), PX4FLOW2.0_CAM_X0 (U$5.19)
DCMI_D8: PX4FLOW2.0_CPU_X0 (U2.78), PX4FLOW2.0_CAM_X0 (U$5.45)
DCMI_D9: PX4FLOW2.0_CPU_X0 (U2.80), PX4FLOW2.0_CAM_X0 (U$5.44)
DCMI_HSYNC: PX4FLOW2.0_CPU_X0 (U2.29), PX4FLOW2.0_CAM_X0 (U$5.20)
DCMI_PIXCK: PX4FLOW2.0_CPU_X0 (U2.31), PX4FLOW2.0_CAM_X0 (U$5.46)
DCMI_VSYNC: PX4FLOW2.0_CPU_X0 (U2.93), PX4FLOW2.0_CAM_X0 (U$5.21)
Green_Led: PX4FLOW2.0_Power_X0 (R15.2), PX4FLOW2.0_CPU_X0 (U2.42)
I2C1_SCL_EXT: PX4FLOW2.0_CPU_X0 (R3.2), PX4FLOW2.0_Connectors_X0 (LIDAR.3)
I2C1_SDA_EXT: PX4FLOW2.0_CPU_X0 (R4.2), PX4FLOW2.0_Connectors_X0 (LIDAR.2)
I2C2_SCL: PX4FLOW2.0_CPU_X0 (R1.2 U2.47 U8.6), PX4FLOW2.0_CAM_X0 (U$5.25)
I2C2_SDA: PX4FLOW2.0_CPU_X0 (R2.1 U2.48 U8.5), PX4FLOW2.0_CAM_X0 (U$5.24)
~{JTRST}: PX4FLOW2.0_CPU_X0 (U2.90), PX4FLOW2.0_Connectors_X0 (J2.10)
JTCK-SWCLK: PX4FLOW2.0_CPU_X0 (U2.76), PX4FLOW2.0_Connectors_X0 (J2.4)
JTDI: PX4FLOW2.0_CPU_X0 (U2.77), PX4FLOW2.0_Connectors_X0 (J2.8)
JTDO: PX4FLOW2.0_CPU_X0 (U2.89), PX4FLOW2.0_Connectors_X0 (J2.6)
JTMS-SWDIO: PX4FLOW2.0_CPU_X0 (U2.72), PX4FLOW2.0_Connectors_X0 (J2.2)
~{MPU_CS}: PX4FLOW2.0_CPU_X0 (U2.67), PX4FLOW2.0_Sensors_CAN_X0 (U405.22)
MAG_DRDY---: PX4FLOW2.0_CPU_X0 (U2.36), PX4FLOW2.0_Connectors_X0 (P5.2)
OTG_FS_ID: PX4FLOW2.0_CPU_X0 (U2.69), PX4FLOW2.0_Connectors_X0 (R7.2)
OTG_FS_N: PX4FLOW2.0_CPU_X0 (U2.70), PX4FLOW2.0_Connectors_X0 (R6.2)
OTG_FS_P: PX4FLOW2.0_CPU_X0 (U2.71), PX4FLOW2.0_Connectors_X0 (R8.2)
Power: PX4FLOW2.0_CPU_X0 (R12.1 U2.61), PX4FLOW2.0_Connectors_X0 (LIDAR.5)
PRES_DRDY---: PX4FLOW2.0_CPU_X0 (U2.35), PX4FLOW2.0_Connectors_X0 (P5.1)
PWM: PX4FLOW2.0_CPU_X0 (U2.60), PX4FLOW2.0_Connectors_X0 (J4.PW LIDAR.4)
Red_led: PX4FLOW2.0_Power_X0 (R14.2), PX4FLOW2.0_CPU_X0 (U2.40)
SPI1_MOSI---: PX4FLOW2.0_CPU_X0 (U2.32), PX4FLOW2.0_Connectors_X0 (P5.4)
SPI2_MISO: PX4FLOW2.0_CPU_X0 (U2.53), PX4FLOW2.0_Sensors_CAN_X0 (U12.4 U405.9)
SPI2_MOSI: PX4FLOW2.0_CPU_X0 (U2.54), PX4FLOW2.0_Sensors_CAN_X0 (U12.3 U405.24)
SPI2_NSS: PX4FLOW2.0_CPU_X0 (U2.51), PX4FLOW2.0_Sensors_CAN_X0 (U12.5)
SPI2_SCK: PX4FLOW2.0_CPU_X0 (U2.52), PX4FLOW2.0_Sensors_CAN_X0 (U12.2 U405.23)
TIM5_CH1: PX4FLOW2.0_CPU_X0 (U2.23), PX4FLOW2.0_Connectors_X0 (P5.7)
TIM5_CH3_EXPOSURE: PX4FLOW2.0_CPU_X0 (U2.25), PX4FLOW2.0_CAM_X0 (U$5.23)
TIM5_CH4_STANDBY: PX4FLOW2.0_CPU_X0 (U2.26), PX4FLOW2.0_CAM_X0 (U$5.33)
TIM8_CH3_MASTERCLOCK: PX4FLOW2.0_CPU_X0 (U2.65), PX4FLOW2.0_CAM_X0 (U$5.47)
TIM8_CH4_LED_OUT: PX4FLOW2.0_CPU_X0 (U2.66), PX4FLOW2.0_CAM_X0 (U$5.27)
UART4_RX: PX4FLOW2.0_CPU_X0 (U2.79), PX4FLOW2.0_Connectors_X0 (R10.2 R11.2)
US_EN1: PX4FLOW2.0_CPU_X0 (U2.39), PX4FLOW2.0_Connectors_X0 (J4.RX)
US_EN2: PX4FLOW2.0_CPU_X0 (U2.41), PX4FLOW2.0_Connectors_X0 (P5.8)
USART2_CTS: PX4FLOW2.0_CPU_X0 (U2.84), PX4FLOW2.0_Connectors_X0 (P2.4)
USART2_RTS: PX4FLOW2.0_CPU_X0 (U2.85), PX4FLOW2.0_Connectors_X0 (P2.5)
USART2_RX: PX4FLOW2.0_CPU_X0 (U2.87), PX4FLOW2.0_Connectors_X0 (P2.3)
USART2_TX: PX4FLOW2.0_CPU_X0 (U2.86), PX4FLOW2.0_Connectors_X0 (P2.2)
USART3_CK: PX4FLOW2.0_CPU_X0 (U2.57), PX4FLOW2.0_Connectors_X0 (P5.3)
USART3_CTS: PX4FLOW2.0_CPU_X0 (U2.58), PX4FLOW2.0_Connectors_X0 (P3.5)
USART3_RTS: PX4FLOW2.0_CPU_X0 (U2.59), PX4FLOW2.0_Connectors_X0 (P3.4)
USART3_RX: PX4FLOW2.0_CPU_X0 (U2.56), PX4FLOW2.0_Connectors_X0 (P3.2)
USART3_TX: PX4FLOW2.0_CPU_X0 (U2.55), PX4FLOW2.0_Connectors_X0 (P3.3)
VBUS: PX4FLOW2.0_CPU_X0 (U2.68), PX4FLOW2.0_Connectors_X0 (J5.VBUS L8.2)
VDD_5V: PX4FLOW2.0_Power_X0 (9 pins), PX4FLOW2.0_CPU_X0 (VDD_5V.P$1), PX4FLOW2.0_Connectors_X0 (D1.CATHODE R10.1)
VDD_5V_IN: PX4FLOW2.0_Power_X0 (Q1.1 Q1.2 Q1.5 Q1.6), PX4FLOW2.0_Connectors_X0 (L1.1 L3.1 L103.P$1 L106.P$1)
VDD_SONAR: PX4FLOW2.0_Power_X0 (JP1.2), PX4FLOW2.0_Connectors_X0 (J4.VDD)

## Assembly variants
PX4FLOW2.0_X0: not fitted !RESET BOOT0 BOOT1 J2 J4 P2 P3 P4 P5 P6 U$1 U$3 U$4 U$8 U$9 U$10 VDD_3V3 VDD_3V3_ANALOG VDD_5V